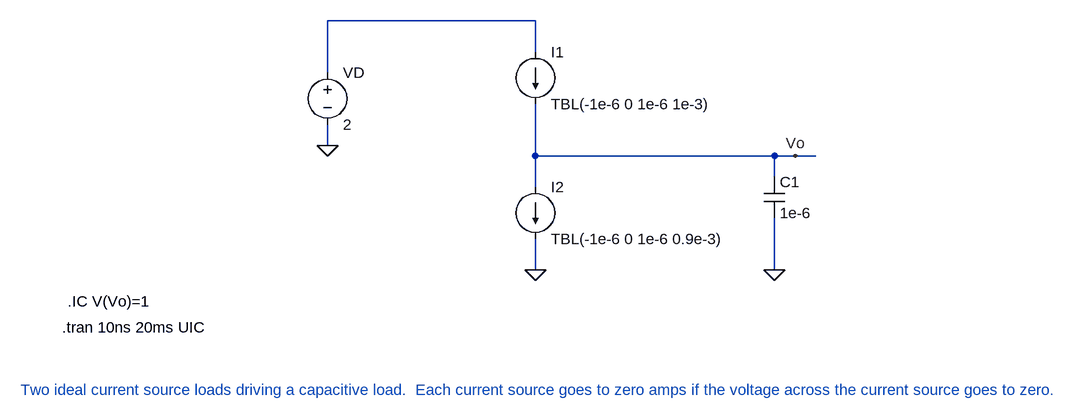
[diagram p0: schematic 2_ideal_current_sources.asc]
2_ideal_current_sources.asc, the LTspice schematic file:
Version 4
SHEET 1 980 680
WIRE 160 -144 -160 -144
WIRE 160 -96 160 -144
WIRE -160 -64 -160 -144
WIRE -160 48 -160 16
WIRE 160 64 160 -16
WIRE 528 64 160 64
WIRE 560 64 528 64
WIRE 592 64 560 64
WIRE 528 96 528 64
WIRE 160 112 160 64
WIRE 160 240 160 192
WIRE 528 240 528 160
FLAG -160 48 0
FLAG 160 240 0
FLAG 528 240 0
FLAG 560 64 Vo
SYMBOL voltage -160 -80 R0
WINDOW 123 0 0 Left 2
WINDOW 39 0 0 Left 2
SYMATTR InstName VD
SYMATTR Value 2
SYMBOL current 160 -96 R0
SYMATTR InstName I1
SYMATTR Value TBL(-1e-6 0 1e-6 1e-3)
SYMBOL current 160 112 R0
SYMATTR InstName I2
SYMATTR Value TBL(-1e-6 0 1e-6 0.9e-3)
SYMBOL cap 512 96 R0
SYMATTR InstName C1
SYMATTR Value 1e-6
TEXT -632 424 Left 2 ;Two ideal current source loads driving a capacitive load.  Each current source goes to zero amps if the voltage across the current source goes to zero.
TEXT -568 328 Left 2 !.tran 10ns 20ms UIC
TEXT -560 288 Left 2 !.IC V(Vo)=1

The netlist it stands for:
* 2_ideal_current_sources.asc
VD N001 0 2
I1 N001 Vo TBL(-1e-6 0 1e-6 1e-3)
I2 Vo 0 TBL(-1e-6 0 1e-6 0.9e-3)
C1 Vo 0 1e-6
* Two ideal current source loads driving a capacitive load.  Each current source goes to zero amps if the voltage across the current source goes to zero.
.tran 10ns 20ms UIC
.IC V(Vo)=1
.backanno
.end